# Altium schematic sheet Walrus Radios.SchDoc: Radio
size B; PageSetup: Record=PageOptions|CenterHorizontal=True|CenterVertical=True|PrintScale=1.05|XCorrection=1.00|YCorrection=1.00|PrintKind=2|BorderSize=5000000|LeftOffset=0|BottomOffset=0|Orientation=2|PaperLength=1000|PaperWidth=1000|Scale=100|PaperSource=7|PrintQuality=-4|MediaType=1|DitherType=10|PaperKind=Letter|PrintScaleMode=1; Organization: Morewood Design Labs, Inc.; Address1: 5001 Baum Blvd.; Address2: Suite 675; Address3: Pittsburgh, PA 15213; Address4: 412-687-1110; SheetNumber: 4; SheetTotal: 4; Client: Test; Project: {ENTER PROJECT}; MdlPcbNumber: Test; ClientPcbNumber: Test; ClientPcbaNumber: Test; ClientPcbaRev: Test; ClientPcbRev: Test; ProjectName: Walrus
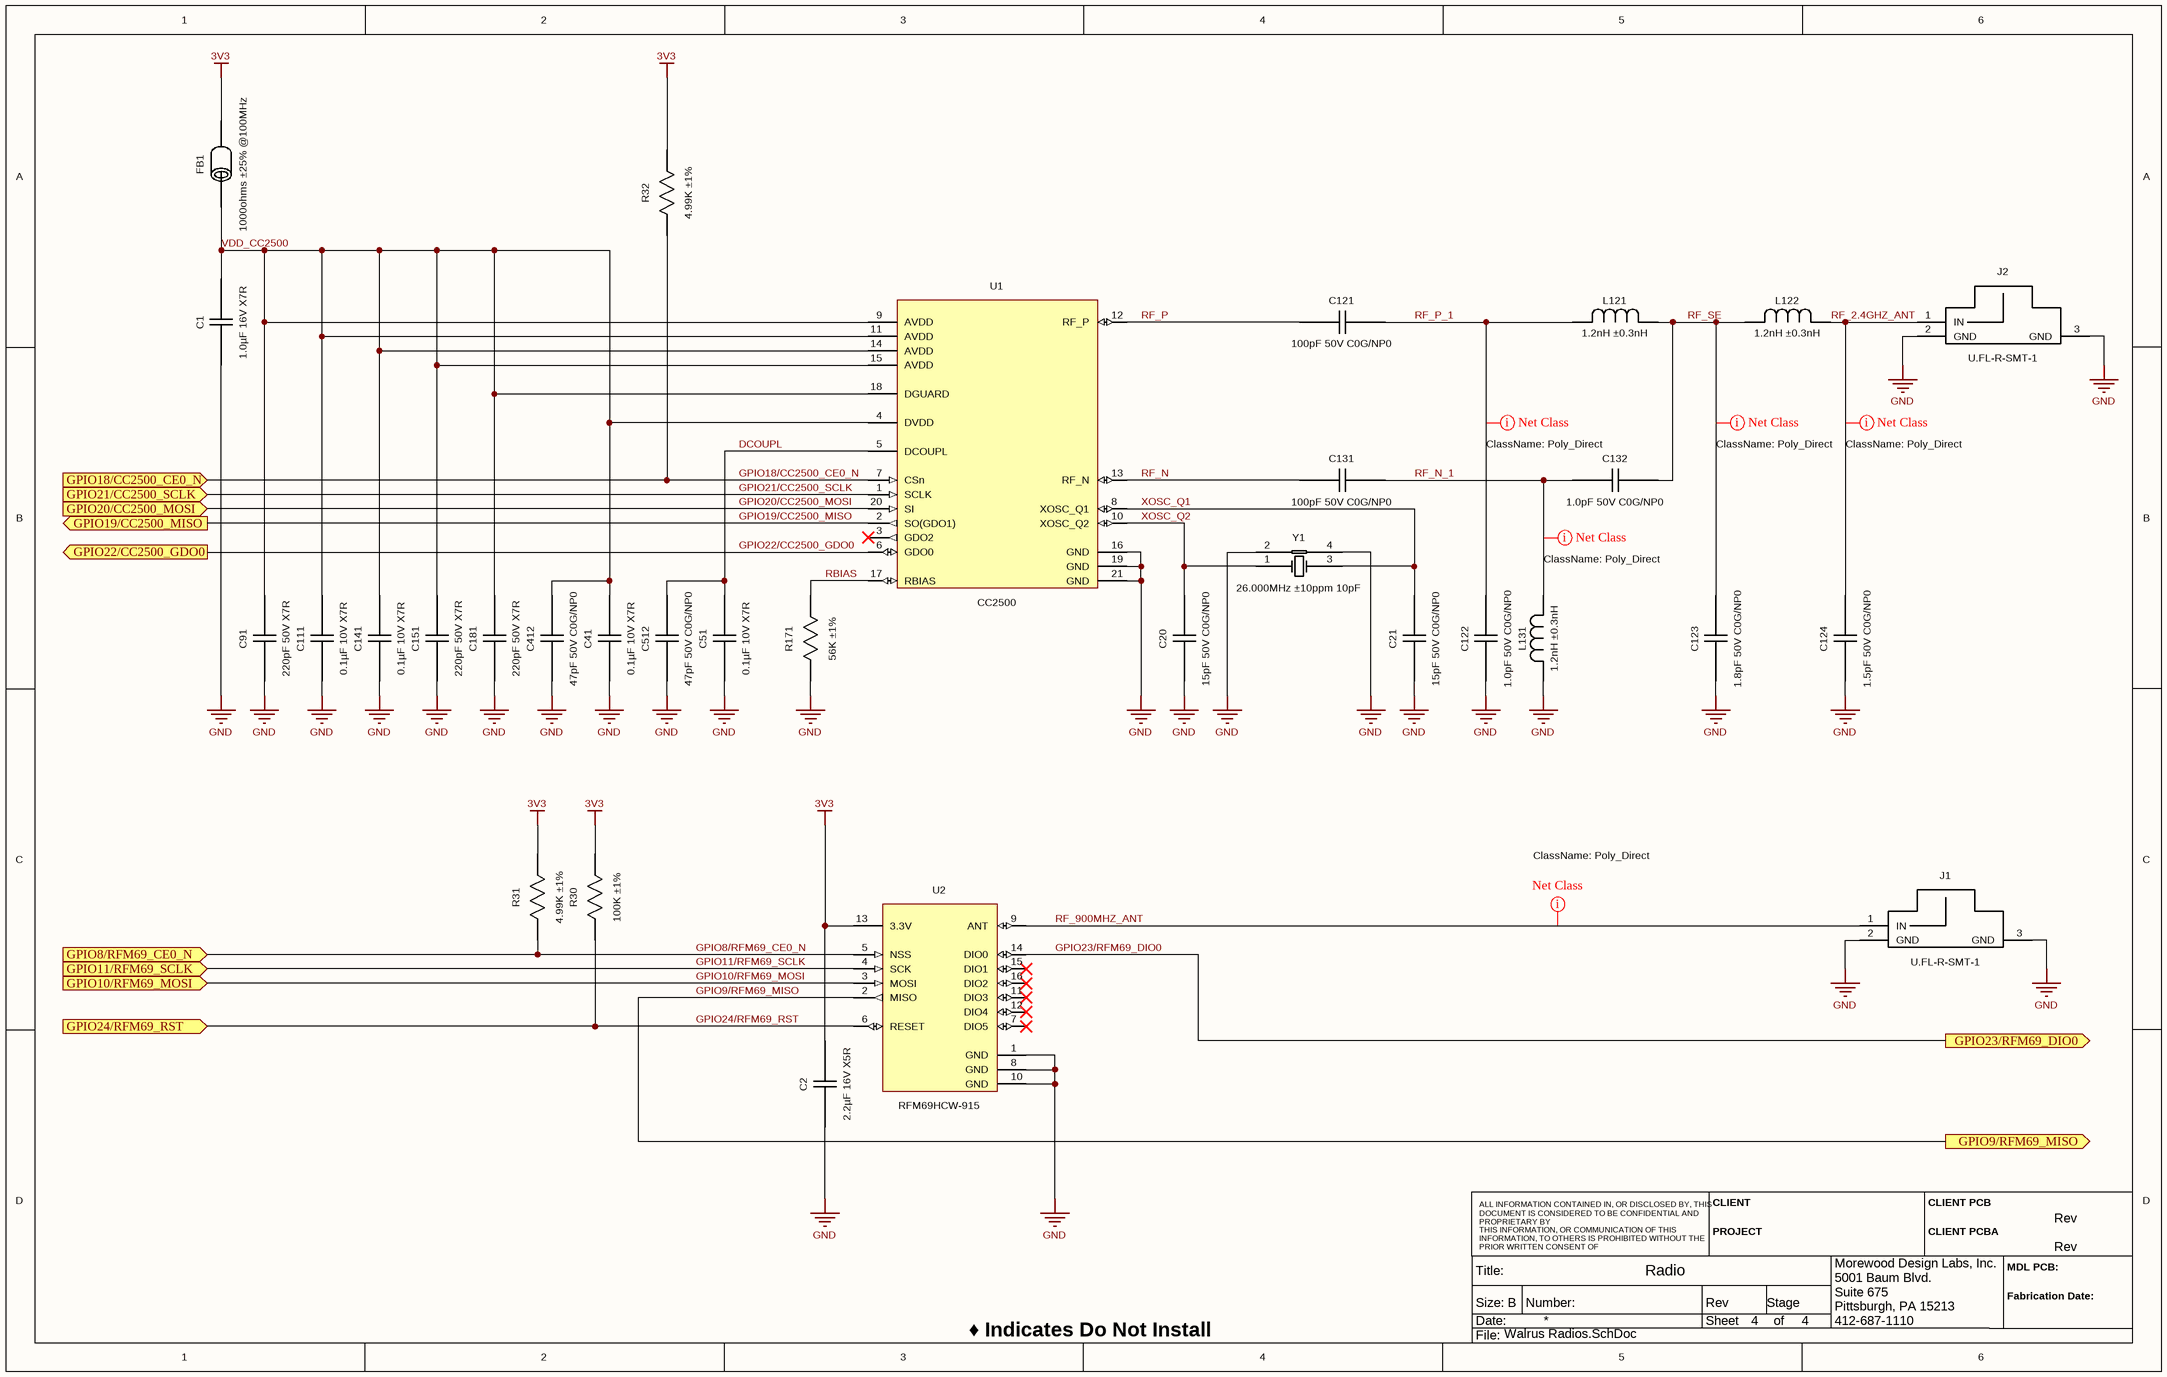
[diagram p0: Walrus Radios.SchDoc]

## Parts
C1  1.0µF 16V X7R  [CAPC1608X90L(0603)]
C2  2.2µF 16V X5R  [CAPC1005X60L(0402)]
C20  15pF 50V C0G/NP0  [CAPC1005X60L(0402_FLEXTRONICS)]
C21  15pF 50V C0G/NP0  [CAPC1005X60L(0402_FLEXTRONICS)]
C41  0.1µF 10V X7R  [CAPC1005X60L(0402_FLEXTRONICS)]
C51  0.1µF 10V X7R  [CAPC1005X60L(0402_FLEXTRONICS)]
C91  220pF 50V X7R  [CAPC1005X60L(0402_FLEXTRONICS)]
C111  0.1µF 10V X7R  [CAPC1005X60L(0402_FLEXTRONICS)]
C121  100pF 50V C0G/NP0  [CAPC1005X60L(0402_FLEXTRONICS)]
C122  1.0pF 50V C0G/NP0  [CAPC1005X60L(0402_FLEXTRONICS)]
C123  1.8pF 50V C0G/NP0  [CAPC1005X60L(0402_FLEXTRONICS)]
C124  1.5pF 50V C0G/NP0  [CAPC1005X60L(0402_FLEXTRONICS)]
C131  100pF 50V C0G/NP0  [CAPC1005X60L(0402_FLEXTRONICS)]
C132  1.0pF 50V C0G/NP0  [CAPC1005X60L(0402_FLEXTRONICS)]
C141  0.1µF 10V X7R  [CAPC1005X60L(0402_FLEXTRONICS)]
C151  220pF 50V X7R  [CAPC1005X60L(0402_FLEXTRONICS)]
C181  220pF 50V X7R  [CAPC1005X60L(0402_FLEXTRONICS)]
C412  47pF 50V C0G/NP0  [CAPC1005X60L(0402_FLEXTRONICS)]
C512  47pF 50V C0G/NP0  [CAPC1005X60L(0402_FLEXTRONICS)]
FB1  1000ohms ±25% @100MHz  [FBDC1005X60L(0402)]
J1  U.FL-R-SMT-1  [HIROSE_U.FL-R-SMT-1]
J2  U.FL-R-SMT-1  [HIROSE_U.FL-R-SMT-1]
L121  1.2nH ±0.3nH  [INDC1005X60L(0402)]
L122  1.2nH ±0.3nH  [INDC1005X60L(0402)]
L131  1.2nH ±0.3nH  [INDC1005X60L(0402)]
R30  100K ±1%  [RESC1005X40L(0402)]
R31  4.99K ±1%  [RESC1005X40L(0402)]
R32  4.99K ±1%  [RESC1005X40L(0402)]
R171  56K ±1%  [RESC1005X40L(0402)]
U1  CC2500  [QFN50P400X400X100-21N(CC2500)]
U2  RFM69HCW-915  [RFM69HCW]
Y1  26.000MHz ±10ppm 10pF  [XTAL500X320X110-4N(ABM3B)]

## Ports
GPIO8/RFM69_CE0_N (in), GPIO9/RFM69_MISO (out), GPIO10/RFM69_MOSI (in), GPIO11/RFM69_SCLK (in), GPIO18/CC2500_CE0_N (in), GPIO19/CC2500_MISO (out), GPIO20/CC2500_MOSI (in), GPIO21/CC2500_SCLK (in), GPIO22/CC2500_GDO0 (out), GPIO23/RFM69_DIO0 (out), GPIO24/RFM69_RST (in)

## Nets
3V3: C2.2 FB1.2 R30.2 R31.2 R32.2 U2.13(3.3V)
GND: C1.1 C2.1 C20.1 C21.1 C41.1 C51.1 C91.1 C111.1 C122.1 C123.1 C124.1 C141.1 C151.1 C181.1 C412.1 C512.1 J1.2(GND) J1.3(GND) J2.2(GND) J2.3(GND) L131.1 R171.1 U1.16(GND) U1.19(GND) U1.21(GND) U2.1(GND) U2.8(GND) U2.10(GND) Y1.2 Y1.4
DCOUPL: C51.2 C512.2 U1.5(DCOUPL)
GPIO8/RFM69_CE0_N: R31.1 U2.5(NSS) ; port GPIO8/RFM69_CE0_N
GPIO9/RFM69_MISO: U2.2(MISO) ; port GPIO9/RFM69_MISO
GPIO10/RFM69_MOSI: U2.3(MOSI) ; port GPIO10/RFM69_MOSI
GPIO11/RFM69_SCLK: U2.4(SCK) ; port GPIO11/RFM69_SCLK
GPIO18/CC2500_CE0_N: R32.1 U1.7(CSn) ; port GPIO18/CC2500_CE0_N
GPIO19/CC2500_MISO: U1.2(SO(GDO1)) ; port GPIO19/CC2500_MISO
GPIO20/CC2500_MOSI: U1.20(SI) ; port GPIO20/CC2500_MOSI
GPIO21/CC2500_SCLK: U1.1(SCLK) ; port GPIO21/CC2500_SCLK
GPIO22/CC2500_GDO0: U1.6(GDO0) ; port GPIO22/CC2500_GDO0
GPIO23/RFM69_DIO0: U2.14(DIO0) ; port GPIO23/RFM69_DIO0
GPIO24/RFM69_RST: R30.1 U2.6(RESET) ; port GPIO24/RFM69_RST
RBIAS: R171.2 U1.17(RBIAS)
RF_2.4GHZ_ANT: C124.2 J2.1(IN) L122.2
RF_900MHZ_ANT: J1.1(IN) U2.9(ANT)
RF_N: C131.1 U1.13(RF_N)
RF_N_1: C131.2 C132.1 L131.2
RF_P: C121.1 U1.12(RF_P)
RF_P_1: C121.2 C122.2 L121.1
RF_SE: C123.2 C132.2 L121.2 L122.1
VDD_CC2500: C1.2 C41.2 C91.2 C111.2 C141.2 C151.2 C181.2 C412.2 FB1.1 U1.4(DVDD) U1.9(AVDD) U1.11(AVDD) U1.14(AVDD) U1.15(AVDD) U1.18(DGUARD)
XOSC_Q1: C21.2 U1.8(XOSC_Q1) Y1.3
XOSC_Q2: C20.2 U1.10(XOSC_Q2) Y1.1

Not connected (* = marked no-connect by the designer): U1 3(GDO2)*; U2 7(DIO5)* 11(DIO3)* 12(DIO4)* 15(DIO1)* 16(DIO2)*

## Layout directives
net class Poly_Direct: RF_2.4GHZ_ANT, RF_900MHZ_ANT, RF_N_1, RF_P_1, RF_SE

## Notes on the sheet
- ♦ Indicates Do Not Install
- ALL INFORMATION CONTAINED IN, OR DISCLOSED BY, THIS DOCUMENT IS CONSIDERED TO BE CONFIDENTIAL AND PROPRIETARY BY
- THIS INFORMATION, OR COMMUNICATION OF THIS INFORMATION, TO OTHERS IS PROHIBITED WITHOUT THE PRIOR WRITTEN CONSENT OF
- CLIENT
- PROJECT
- CLIENT PCB
- CLIENT PCBA
- MDL PCB:
- Rev
- Title:
- Size:
- Date:
- B
- Number:
- Sheet
- Stage
- of
- Fabrication Date:
- File:

## Library data of the parts
C1 = CAP_000045: Ceramic Chip Capacitor; Mfg1PartNumber: EMK107B7105KA-T; Tolerance: ±10%; Mfg1: Taiyo Yuden; MDLPartNumber: CAP_000045; Value: 1.0µF; Dielectric: Ceramic; Voltage: 16V; Mounting: SMT; Case: 1608(0603); Height: 0.90mm(34.4mils); Tempco: X7R; OperatingTemp: -55C to 125C; CreationDate: 11/3/2010; Creator: R. Casciola; LeadFree: True; RoHS: True; Packaging: T&R; ComponentLink1Description: Mfg1 Datasheet; ComponentLink1URL: http://www.yuden.co.jp/ut/product/pdf/djmk_e.pdf; Distributor: https://www.digikey.com/product-detail/en/taiyo-yuden/EMK107B7105KA-T/587-1241-1-ND/931018
C2 = CAP_000166: Ceramic Chip Capacitor; Mfg1PartNumber: C1005X5R1C225K050BC; Tolerance: ±10%; Mfg1: TDK; MDLPartNumber: CAP_000166; Value: 2.2µF; Dialectric: Ceramic; Voltage: 16V; Mounting: SMT; Case: 1005(0402); Height: 0.55mm(21.7mils); Tempco: X5R; OperatingTemp: -55C to 85C; CreationDate: 3/17/2013; Creator: R. Casciola; LeadFree: True; RoHS: True; Packaging: T&R; ComponentLink1Description: Mfg1 Datasheet; ComponentLink1URL: http://product.tdk.com/capacitor/mlcc/en/documents/mlccspec_commercial_general_midvoltage_en.pdf; Distributor: https://www.digikey.com/product-detail/en/tdk-corporation/C1005X5R1C225K050BC/445-9085-1-ND/3661600; ClassName: DirectPour
C20 C21 = CAP_000179: Ceramic Chip Capacitor; Mfg1PartNumber: 04025A150GAT2A; Tolerance: ±2%; Mfg1: AVX; Modifer: R. Casciola; MDLPartNumber: CAP_000179; Value: 15pF; Dielectric: Ceramic; Voltage: 50V; Mounting: SMT; Case: 1005(0402); Height: 0.56mm(22.0mils); Tempco: C0G/NP0; OperatingTemp: -55C to 125C; CreationDate: 1/25/2015; Creator: R. Casciola; LeadFree: True; RoHS: True; Packaging: T&R; ComponentLink1Description: Mfg1 Datasheet; ComponentLink1URL: http://partbuilder.avx.com/p/pb/pdf/1027/C0GNP0-Dielectric.pdf; ModificationDate: 4/15/2016; Distributor: https://www.digikey.com/product-detail/en/avx-corporation/04025A150GAT2A/478-5268-1-ND/1950935
  C21: ClassName: DirectPour
C41 C51 C111 C141 = CAP_000208: Ceramic Chip Capacitor; Mfg1PartNumber: GRM155R71A104KA01D; Tolerance: ±10%; Mfg1: Murata; MDLPartNumber: CAP_000208; Value: 0.1µF; Dielectric: Ceramic; Voltage: 10V; Mounting: SMT; Case: 1005(0402); Height: 0.55mm(21.7mils); Tempco: X7R; OperatingTemp: -55C to 125C; CreationDate: 5/29/2017; Creator: R. Casciola; LeadFree: True; RoHS: True; Packaging: T&R; ComponentLink1Description: Mfg1 Datasheet; ComponentLink1URL: http://search.murata.co.jp/Ceramy/image/img/A01X/G101/ENG/GRM155R71A104KA01-01.pdf; Distributor: https://www.digikey.com/product-detail/en/murata-electronics-north-america/GRM155R71A104KA01D/490-6321-1-ND/3845518; ClassName: DirectPour
C91 C151 C181 = CAP_000207: Ceramic Chip Capacitor; Mfg1PartNumber: GRM155R71H221KA01D; Tolerance: ±10%; Mfg1: Murata; MDLPartNumber: CAP_000207; Value: 220pF; Dielectric: Ceramic; Voltage: 50V; Mounting: SMT; Case: 1005(0402); Height: 0.55mm(21.7mils); Tempco: X7R; OperatingTemp: -55C to 125C; CreationDate: 5/29/2017; Creator: R. Casciola; LeadFree: True; RoHS: True; Packaging: T&R; ComponentLink1Description: Mfg1 Datasheet; ComponentLink1URL: http://search.murata.co.jp/Ceramy/image/img/A01X/G101/ENG/GRM155R71H221KA01-01.pdf; Distributor: https://www.digikey.com/product-detail/en/murata-electronics-north-america/GRM155R71H221KA01D/490-1298-1-ND/587937; ClassName: DirectPour
C121 C131 = CAP_000202: Ceramic Chip Capacitor; Mfg1PartNumber: GRM1555C1H101JA01D; Tolerance: ±5%; Mfg1: Murata; MDLPartNumber: CAP_000202; Value: 100pF; Dielectric: Ceramic; Voltage: 50V; Mounting: SMT; Case: 1005(0402); Height: 0.55mm(21.7mils); Tempco: C0G/NP0; OperatingTemp: -55C to 125C; CreationDate: 5/29/2017; Creator: R. Casciola; LeadFree: True; RoHS: True; Packaging: T&R; ComponentLink1Description: Mfg1 Datasheet; ComponentLink1URL: http://search.murata.co.jp/Ceramy/image/img/A01X/G101/ENG/GRM1555C1H101JA01-01.pdf; Distributor: https://www.digikey.com/product-detail/en/murata-electronics-north-america/GRM1555C1H101JA01D/490-5922-1-ND/3721279
C122 C132 = CAP_000206: Ceramic Chip Capacitor; Mfg1PartNumber: GRM1555C1H1R0CA01D; Tolerance: ±0.25pF; Mfg1: Murata; MDLPartNumber: CAP_000206; Value: 1.0pF; Dielectric: Ceramic; Voltage: 50V; Mounting: SMT; Case: 1005(0402); Height: 0.55mm(21.7mils); Tempco: C0G/NP0; OperatingTemp: -55C to 125C; CreationDate: 5/29/2017; Creator: R. Casciola; LeadFree: True; RoHS: True; Packaging: T&R; ComponentLink1Description: Mfg1 Datasheet; Distributor: https://www.digikey.com/product-detail/en/murata-electronics-north-america/GRM1555C1H1R0CA01D/490-3199-1-ND/702740
  C122: ComponentLink1URL: http://search.murata.co.jp/Ceramy/image/img/A01X/G101/ENG/GRM1555C1H1R5CA01-01.pdf; ClassName: DirectPour
  C132: ComponentLink1URL: http://search.murata.co.jp/Ceramy/image/img/A01X/G101/ENG/GRM1555C1H1R0CA01-01.pdf
C123 = CAP_000204: Ceramic Chip Capacitor; Mfg1PartNumber: GRM1555C1H1R8CA01D; Tolerance: ±0.25pF; Mfg1: Murata; MDLPartNumber: CAP_000204; Value: 1.8pF; Dielectric: Ceramic; Voltage: 50V; Mounting: SMT; Case: 1005(0402); Height: 0.55mm(21.7mils); Tempco: C0G/NP0; OperatingTemp: -55C to 125C; CreationDate: 5/29/2017; Creator: R. Casciola; LeadFree: True; RoHS: True; Packaging: T&R; ComponentLink1Description: Mfg1 Datasheet; ComponentLink1URL: http://search.murata.co.jp/Ceramy/image/img/A01X/G101/ENG/GRM1555C1H1R8CA01-01.pdf; Distributor: https://www.digikey.com/product-detail/en/murata-electronics-north-america/GRM1555C1H1R8CA01D/490-5898-1-ND/3569084; ClassName: DirectPour
C124 = CAP_000205: Ceramic Chip Capacitor; Mfg1PartNumber: GRM1555C1H1R5CA01D; Tolerance: ±0.25pF; Mfg1: Murata; MDLPartNumber: CAP_000205; Value: 1.5pF; Dielectric: Ceramic; Voltage: 50V; Mounting: SMT; Case: 1005(0402); Height: 0.55mm(21.7mils); Tempco: C0G/NP0; OperatingTemp: -55C to 125C; CreationDate: 5/29/2017; Creator: R. Casciola; LeadFree: True; RoHS: True; Packaging: T&R; ComponentLink1Description: Mfg1 Datasheet; ComponentLink1URL: http://search.murata.co.jp/Ceramy/image/img/A01X/G101/ENG/GRM1555C1H1R5CA01-01.pdf; Distributor: https://www.digikey.com/product-detail/en/murata-electronics-north-america/GRM1555C1H1R5CA01D/490-5891-1-ND/3481884; ClassName: DirectPour
C412 C512 = CAP_000193: Ceramic Chip Capacitor; Mfg1PartNumber: C0402C470K5GACTU; Tolerance: ±10%; Mfg1: Kemet; MDLPartNumber: CAP_000193; Value: 47pF; Dielectric: Ceramic; Voltage: 50V; Mounting: SMT; Case: 1005(0402); Height: 0.55mm(22.0mils); Tempco: C0G/NP0; OperatingTemp: -55C to 125C; CreationDate: 4/8/2015; Creator: R. Casciola; LeadFree: True; RoHS: True; Packaging: T&R; ComponentLink1Description: Mfg1 Datasheet; ComponentLink1URL: http://capacitoredge.kemet.com/capedge2/intellispec.jsp?pn=C0402C470K5GACTU&displayPN=C0402C470K5GACTU; Distributor: https://www.digikey.com/product-detail/en/kemet/C0402C470K5GACTU/399-7796-1-ND/3471519; ClassName: DirectPour
FB1 = FB_000009: GHz Noise Suppression Chip Ferrite Bead; Mfg1PartNumber: BLM15HG102SN1D; Freqency: 100MHz; DCResistance(max): 1.2ohms; Current(max): 250mA; Mfg1: Murata; MDLPartNumber: FB_000009; Value: 1000ohms; Tolerance: ±25%; Mounting: SMT; Case: 1005(0402); Height: 0.55mm(21.7mils); OperatingTemp: -55C to 125C; CreationDate: 5/29/2017; Creator: R. Casciola; LeadFree: True; RoHS: True; Packaging: T&R; ComponentLink1Description: Mfg1 Datasheet; ComponentLink1URL: http://www.murata.com/en-global/products/productdata/8796740223006/ENFA0024.pdf; Distributor: https://www.digikey.com/product-detail/en/murata-electronics-north-america/BLM15HG102SN1D/490-3999-1-ND/1016259
J1 J2 = CONN_000064: Ultra Small Surface Mount Coaxial Connectors - 1.9mm or 2.4mm Mated Height; Mfg1PartNumber: U.FL-R-SMT-1,U.FL-R-SMT-1(10),U.FL-R-SMT-1(40); Mfg1: Hirose; Modifer: R. Casciola; MDLPartNumber: CONN_000064; Mounting: SMT; Height: 1.25mm; CreationDate: 7/25/2010; Creator: R. Casciola; LeadFree: True; RoHS: True; ComponentLink1Description: Mfg1 Datasheet; ComponentLink1URL: http://www.hirose.co.jp/cataloge_hp/e32119372.pdf; Distributor: https://www.digikey.com/product-detail/en/hirose-electric-co-ltd/U.FL-R-SMT-1(10)/H11891CT-ND/2504612; ModificationDate: 8/24/2017; ClassName: DirectPour
L121 L122 L131 = IND_000048: Surface Mount Multilayer RF Chip Inductors; Mfg1PartNumber: LQG15HS1N2S02D; Q(Freq): 8(100MHz); SRF: 6000MHz; Mfg1: Murata; MDLPartNumber: IND_000048; Value: 1.2nH; Tolerance: ±0.3nH; Mounting: SMT; Case: 1005(0402); Height: 0.55mm(21.6mils); OperatingTemp: -55C to 125C; CreationDate: 5/29/2017; Creator: R. Casciola; LeadFree: True; RoHS: True; Packaging: T&R; ComponentLink1Description: Mfg1 Datasheet; ComponentLink1URL: http://psearch.en.murata.com/inductor/product/LQG15HS1N2S02_.pdf; Distributor: https://www.digikey.com/product-detail/en/murata-electronics-north-america/LQG15HS1N2S02D/490-2611-1-ND/662891
  L131: ClassName: DirectPour
R30 = RES_000067: Chip Resistor, Thick Film; Mfg1PartNumber: CRCW0402100KFKED; Power: 0.063W; LE Voltage: 50V; Tempco: ±100ppm/C; Mfg1: Vishay/Dale; DNI: *; MDLPartNumber: RES_000067; Value: 100K; Tolerance: ±1%; Mounting: SMT; Case: 1005(0402); Height: 0.40mm(15.7mils); Composition: Thick Film; OperatingTemp: -55C to 155C; CreationDate: 12/22/2010; Creator: R. Casciola; LeadFree: True; RoHS: True; Packaging: T&R; ComponentLink1Description: Mfg1 Datasheet; ComponentLink1URL: http://www.vishay.com/docs/20035/dcrcwe3.pdf; Distributor: https://www.digikey.com/product-detail/en/vishay-dale/CRCW0402100KFKED/541-100KLCT-ND/1183351
R31 R32 = RES_000003: Chip Resistor, Thick Film; Mfg1PartNumber: CRCW04024K99FKED; Power: 0.063W; LE Voltage: 50V; Tempco: ±100ppm/C; Mfg1: Vishay/Dale; DNI: *; MDLPartNumber: RES_000003; Value: 4.99K; Tolerance: ±1%; Mounting: SMT; Case: 1005(0402); Height: 0.40mm(15.7mils); Composition: Thick Film; OperatingTemp: -55C to 155C; CreationDate: 4/6/2010; Creator: R. Casciola; LeadFree: True; RoHS: True; Packaging: T&R; ComponentLink1Description: Mfg1 Datasheet; ComponentLink1URL: http://www.vishay.com/docs/20035/dcrcwe3.pdf; Distributor: https://www.digikey.com/product-detail/en/vishay-dale/CRCW04024K99FKED/541-4.99KLCT-ND/1183202
R171 = RES_000185: Chip Resistor, Thick Film; Mfg1PartNumber: CRCW040256K0FKED; Power: 0.063W; LE Voltage: 50V; Tempco: ±100ppm/C; Mfg1: Vishay/Dale; DNI: *; MDLPartNumber: RES_000185; Value: 56K; Tolerance: ±1%; Mounting: SMT; Case: 1005(0402); Height: 0.40mm(15.7mils); Composition: Thick Film; OperatingTemp: -55C to 155C; CreationDate: 10/15/2012; Creator: R. Casciola; LeadFree: True; RoHS: True; Packaging: T&R; ComponentLink1Description: Mfg1 Datasheet; ComponentLink1URL: http://www.vishay.com/docs/20035/dcrcwe3.pdf; Distributor: https://www.digikey.com/product-detail/en/vishay-dale/CRCW040256K0FKED/541-56.0KLCT-ND/1183322
U1 = IC_000287: Low-Cost Low-Power 2.4 GHz RF Transceiver; Mfg1PartNumber: CC2500RGP,CC2500RGPR; Mfg1: Texas Instruments; MDLPartNumber: IC_000287; Mounting: SMT; Pins: 20; Case: QFN20; PartMarking: CC2500; Height: 1.00mm(39.4mils); OperatingTemp: -40C to 85C; CreationDate: 5/29/2017; Creator: R. Casciola; LeadFree: True; RoHS: True; Packaging: T&R; ComponentLink1Description: Mfg1 Datasheet; ComponentLink1URL: http://www.ti.com/lit/ds/symlink/cc2500.pdf; Distributor: https://www.digikey.com/product-detail/en/texas-instruments/CC2500RGPR/296-38562-1-ND/5034436
U2 = IC_000286: ISM TRANSCEIVER MODULE; Mfg1PartNumber: RFM69HCW-915S2; Mfg1: HopeRF; Modifer: R. Casciola; MDLPartNumber: IC_000286; Mounting: SMT; Pins: 16; Case: MODULE; Height: 1.8mm(70.9mils); OperatingTemp: -40C to 85C; CreationDate: 5/27/2017; Creator: R. Casciola; LeadFree: True; RoHS: True; ComponentLink1Description: Mfg1 Datasheet; ComponentLink1URL: http://www.hoperf.com/upload/rf/RFM69HCW-V1.1.pdf; Distributor: https://www.sparkfun.com/products/13909; ModificationDate: 8/24/2017; ClassName: DirectPour
Y1 = XTAL_000024: CERAMIC SMD CRYSTAL; Mfg1PartNumber: ABM3B-26.000MHZ-10-1-U-T; ESR: 50; Drive Level: 100µW, max; Aging: ±5ppm; Mfg1: Abracon; MDLPartNumber: XTAL_000024; Value: 26.000MHz; Tolerance: ±10ppm; LoadCapacitance: 10pF; Mounting: SMT; Case: XTAL5032; Height: 1.10mm(43.3mils); OperatingTemp: -10C to 60C; CreationDate: 8/13/2017; Creator: R. Casciola; LeadFree: True; RoHS: True; Packaging: T&R; ComponentLink1Description: Mfg1 Datasheet; ComponentLink1URL: http://www.abracon.com/Resonators/abm3b.pdf; Distributor: https://www.digikey.com/product-detail/en/abracon-llc/ABM3B-26.000MHZ-10-1-U-T/300-8219-1-ND/687912